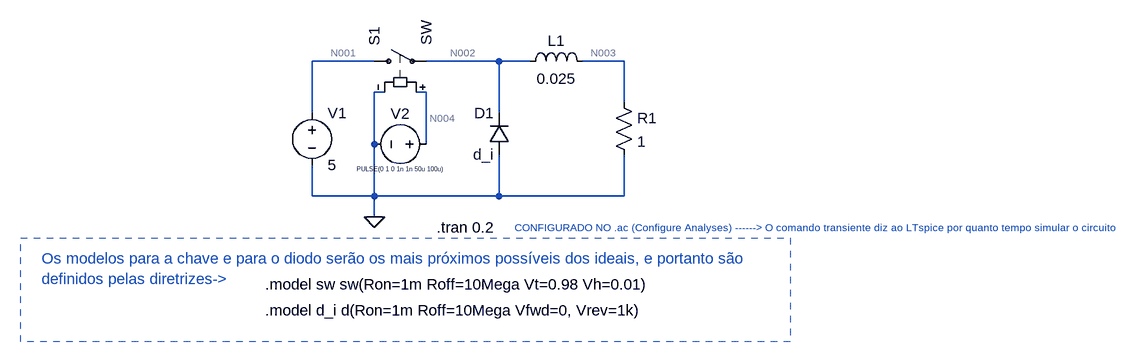
[diagram p0: schematic 01_simulação_felipe.asc]
01_simulação_felipe.asc, the LTspice schematic file:
Version 4.1
SHEET 1 1208 680
WIRE 32 64 -64 64
WIRE 224 64 112 64
WIRE 272 64 224 64
WIRE 416 64 352 64
WIRE 48 112 32 112
WIRE 112 112 96 112
WIRE 416 128 416 64
WIRE -64 144 -64 64
WIRE 224 144 224 64
WIRE 32 192 32 112
WIRE 112 192 112 112
WIRE -64 272 -64 224
WIRE 32 272 32 192
WIRE 32 272 -64 272
WIRE 224 272 224 208
WIRE 224 272 32 272
WIRE 416 272 416 208
WIRE 416 272 224 272
WIRE 32 304 32 272
FLAG 32 304 0
SYMBOL ind 256 80 R270
WINDOW 0 32 56 VTop 2
WINDOW 3 5 56 VBottom 2
SYMATTR InstName L1
SYMATTR Value 0.025
SYMATTR SpiceLine Rser=1m
SYMBOL res 400 112 R0
SYMATTR InstName R1
SYMATTR Value 1
SYMBOL diode 240 208 R180
WINDOW 0 24 64 Left 2
WINDOW 3 24 0 Left 2
SYMATTR InstName D1
SYMATTR Value d_i
SYMBOL sw 16 64 R270
SYMATTR InstName S1
SYMBOL voltage -64 128 R0
WINDOW 123 0 0 Left 0
WINDOW 39 0 0 Left 0
SYMATTR InstName V1
SYMATTR Value 5
SYMBOL voltage 128 192 R90
WINDOW 0 -32 56 VBottom 2
WINDOW 3 38 56 VCenter 0
WINDOW 123 0 0 Left 0
WINDOW 39 0 0 Left 0
SYMATTR InstName V2
SYMATTR Value PULSE(0 1 0 1n 1n 50u 100u)
TEXT 128 320 Left 2 !.tran 0.2
TEXT 248 320 Left 1 ;CONFIGURADO NO .ac (Configure Analyses) ------> O comando transiente diz ao LTspice por quanto tempo simular o circuito
TEXT -480 368 Left 2 ;Os modelos para a chave e para o diodo serão os mais próximos possíveis dos ideais, e portanto são\ndefinidos pelas diretrizes->
TEXT -136 408 Left 2 !.model sw sw(Ron=1m Roff=10Mega Vt=0.98 Vh=0.01)
TEXT -136 448 Left 2 !.model d_i d(Ron=1m Roff=10Mega Vfwd=0, Vrev=1k)
RECTANGLE Normal 672 496 -512 336 2

The netlist it stands for:
* 01_simulação_felipe.asc
L1 N002 N003 0.025 Rser=1m
R1 N003 0 1
D1 0 N002 d_i
S1 N001 N002 N004 0 SW
V1 N001 0 5
V2 N004 0 PULSE(0 1 0 1n 1n 50u 100u)
.model D D
.lib standard.dio
.tran 0.2
* CONFIGURADO NO .ac (Configure Analyses) ------> O comando transiente diz ao LTspice por quanto tempo simular o circuito
* Os modelos para a chave e para o diodo serão os mais próximos possíveis dos ideais, e portanto são
* definidos pelas diretrizes->
.model sw sw(Ron=1m Roff=10Mega Vt=0.98 Vh=0.01)
.model d_i d(Ron=1m Roff=10Mega Vfwd=0, Vrev=1k)
.backanno
.end

* Results of the author's LTspice run, read from the files saved beside the schematic
* Operating Point, zero values left out:
*   V(n001) = 5 V
*   V(n002) = 500.5 nV
*   V(n003) = 500 nV
*   I(L1) = 500 nA
*   I(R1) = 500 nA
*   I(S1) = -500 nA
*   I(V1) = -500 nA
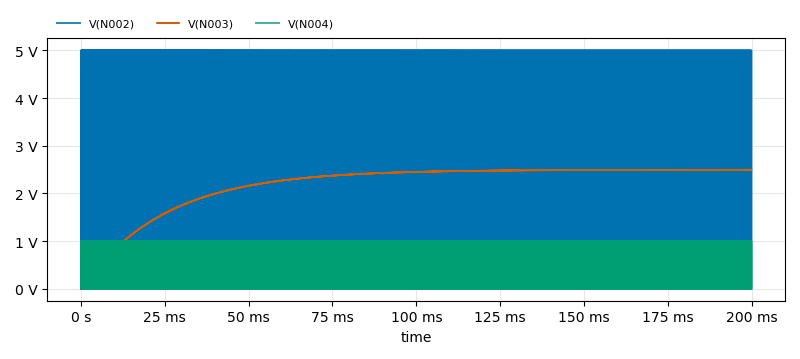
[diagram p1: Transient Analysis of 01_simulação_felipe.asc, plotted from the saved traces]
* Transient Analysis, 1 run:
*   V(N002): min -2.497 mV, max 5 V, average 2.498 V, rms 3.534 V, last -2.492 mV
*   V(N003): min 500 nV, max 2.497 V, average 2.184 V, rms 2.25 V, last 2.492 V
*   V(N004): min 0 V, max 1 V, average 500 mV, rms 707.1 mV, last 0 V